# Altium schematic sheet dc_drivers.schdoc
size A4; SheetNumber: 1; SheetTotal: 5
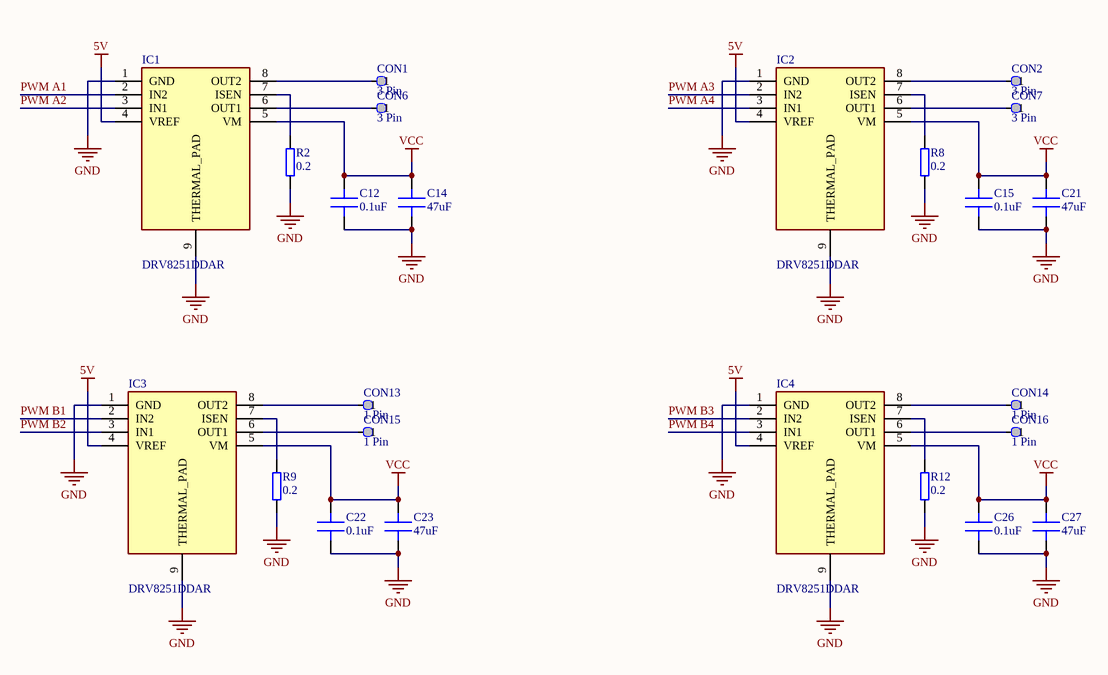
[diagram p0: dc_drivers.schdoc]

## Parts
C12  0.1uF  [C 0402]
C14  47uF  [C 1206]
C15  0.1uF  [C 0402]
C21  47uF  [C 1206]
C22  0.1uF  [C 0402]
C23  47uF  [C 1206]
C26  0.1uF  [C 0402]
C27  47uF  [C 1206]
CON1  3 Pin  [SMD PAD]
CON2  3 Pin  [SMD PAD]
CON6  3 Pin  [SMD PAD]
CON7  3 Pin  [SMD PAD]
CON13  1 Pin  [SMD PAD]
CON14  1 Pin  [SMD PAD]
CON15  1 Pin  [SMD PAD]
CON16  1 Pin  [SMD PAD]
IC1  DRV8251DDAR  [SOIC127P600X170-9N]
IC2  DRV8251DDAR  [SOIC127P600X170-9N]
IC3  DRV8251DDAR  [SOIC127P600X170-9N]
IC4  DRV8251DDAR  [SOIC127P600X170-9N]
R2  0.2  [R 1206]
R8  0.2  [R 1206]
R9  0.2  [R 1206]
R12  0.2  [R 1206]

## Nets
5V: IC1.4(VREF) IC2.4(VREF) IC3.4(VREF) IC4.4(VREF)
GND: C12.2 C14.2 C15.2 C21.2 C22.2 C23.2 C26.2 C27.2 IC1.1(GND) IC1.9(THERMAL_PAD) IC2.1(GND) IC2.9(THERMAL_PAD) IC3.1(GND) IC3.9(THERMAL_PAD) IC4.1(GND) IC4.9(THERMAL_PAD) R2.2 R8.2 R9.2 R12.2
VCC: C12.1 C14.1 C15.1 C21.1 C22.1 C23.1 C26.1 C27.1 IC1.5(VM) IC2.5(VM) IC3.5(VM) IC4.5(VM)
PWM A1: IC1.2(IN2)
PWM A2: IC1.3(IN1)
PWM A3: IC2.2(IN2)
PWM A4: IC2.3(IN1)
PWM B1: IC3.2(IN2)
PWM B2: IC3.3(IN1)
PWM B3: IC4.2(IN2)
PWM B4: IC4.3(IN1)
NetCON1_1: CON1.1 IC1.8(OUT2)
NetCON2_1: CON2.1 IC2.8(OUT2)
NetCON6_1: CON6.1 IC1.6(OUT1)
NetCON7_1: CON7.1 IC2.6(OUT1)
NetCON13_1: CON13.1 IC3.8(OUT2)
NetCON14_1: CON14.1 IC4.8(OUT2)
NetCON15_1: CON15.1 IC3.6(OUT1)
NetCON16_1: CON16.1 IC4.6(OUT1)
NetIC1_7: IC1.7(ISEN) R2.1
NetIC2_7: IC2.7(ISEN) R8.1
NetIC3_7: IC3.7(ISEN) R9.1
NetIC4_7: IC4.7(ISEN) R12.1

## Library data of the parts
C12 C14 C15 C21-C23 C26 C27 = Capacitor: MLCC Capacitor
CON1 CON2 CON6 CON7 = 1 Pin
IC1-IC4 = DRV8251DDAR: Integrated Circuit; Manufacturer_Name: Texas Instruments; Datasheet Link: https://www.arrow.com/en/products/drv8251ddar/texas-instruments?region=nac; Height: 1.7mm; Manufacturer_Part_Number: DRV8251DDAR; Mouser Part Number: 595-DRV8251DDAR; Mouser Price/Stock: https://www.mouser.co.uk/ProductDetail/Texas-Instruments/DRV8251DDAR?qs=doiCPypUmgHTzZyfapGahQ%3D%3D; Arrow Part Number: DRV8251DDAR; Arrow Price/Stock: https://www.arrow.com/en/products/drv8251ddar/texas-instruments?region=nac
R2 R8 R9 R12 = Resistor: General pourpouse resistor